# Altium schematic sheet C-04 CPU PWR.SchDoc
size 513 x 386 mm; Address1: 350W 9th Ave; Address2: Suite 206; Address3: Escondido CA 92025; Address4: United States; Revision: -; ENG_APP_DATE: --/--/--; DSN_APP_DATE: --/--/--; CHK_APP_DATE: --/--/--
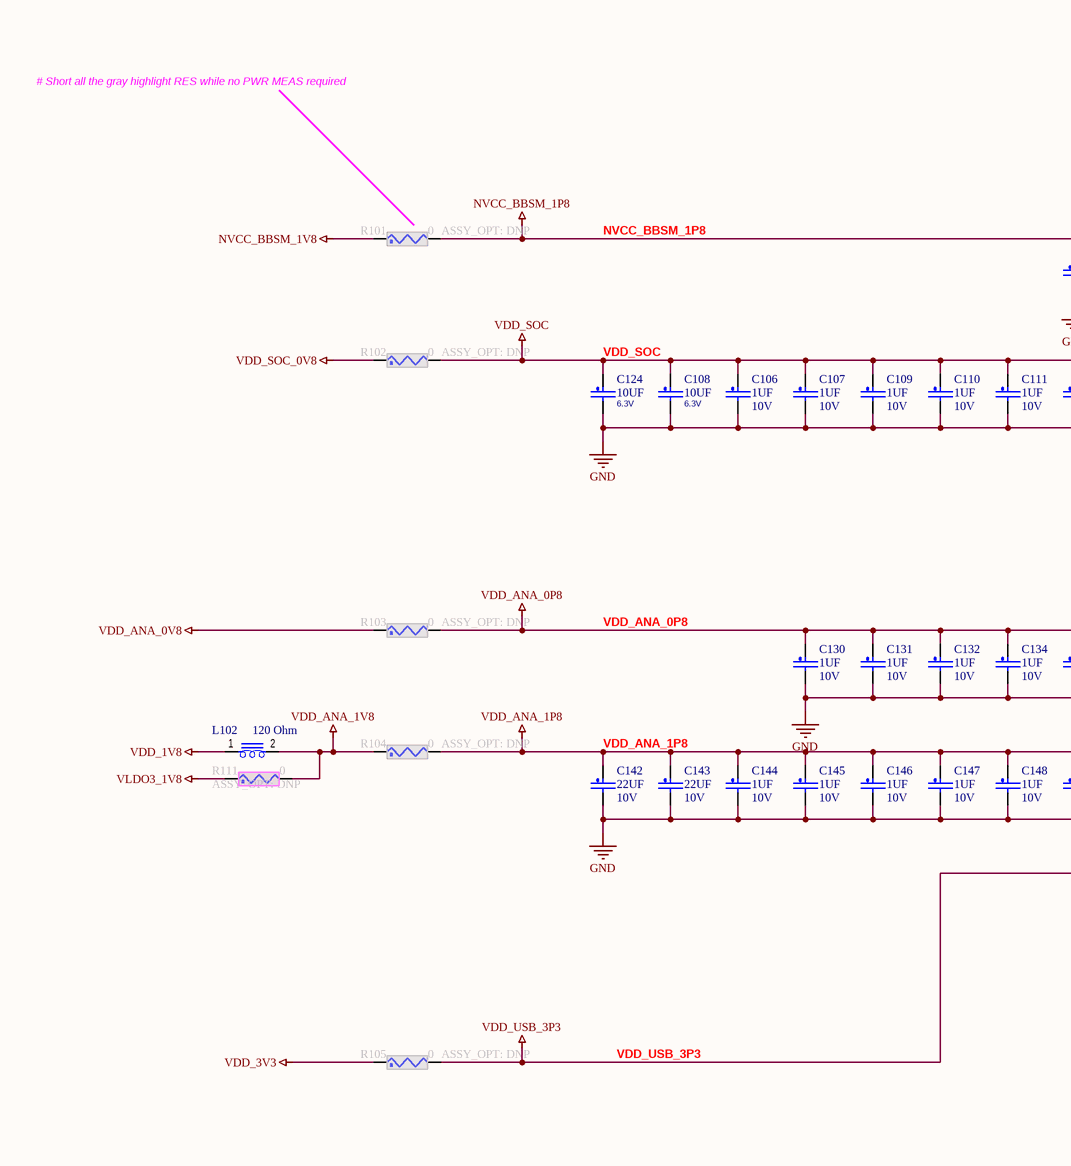
[diagram p0: C-04 CPU PWR.SchDoc, left]
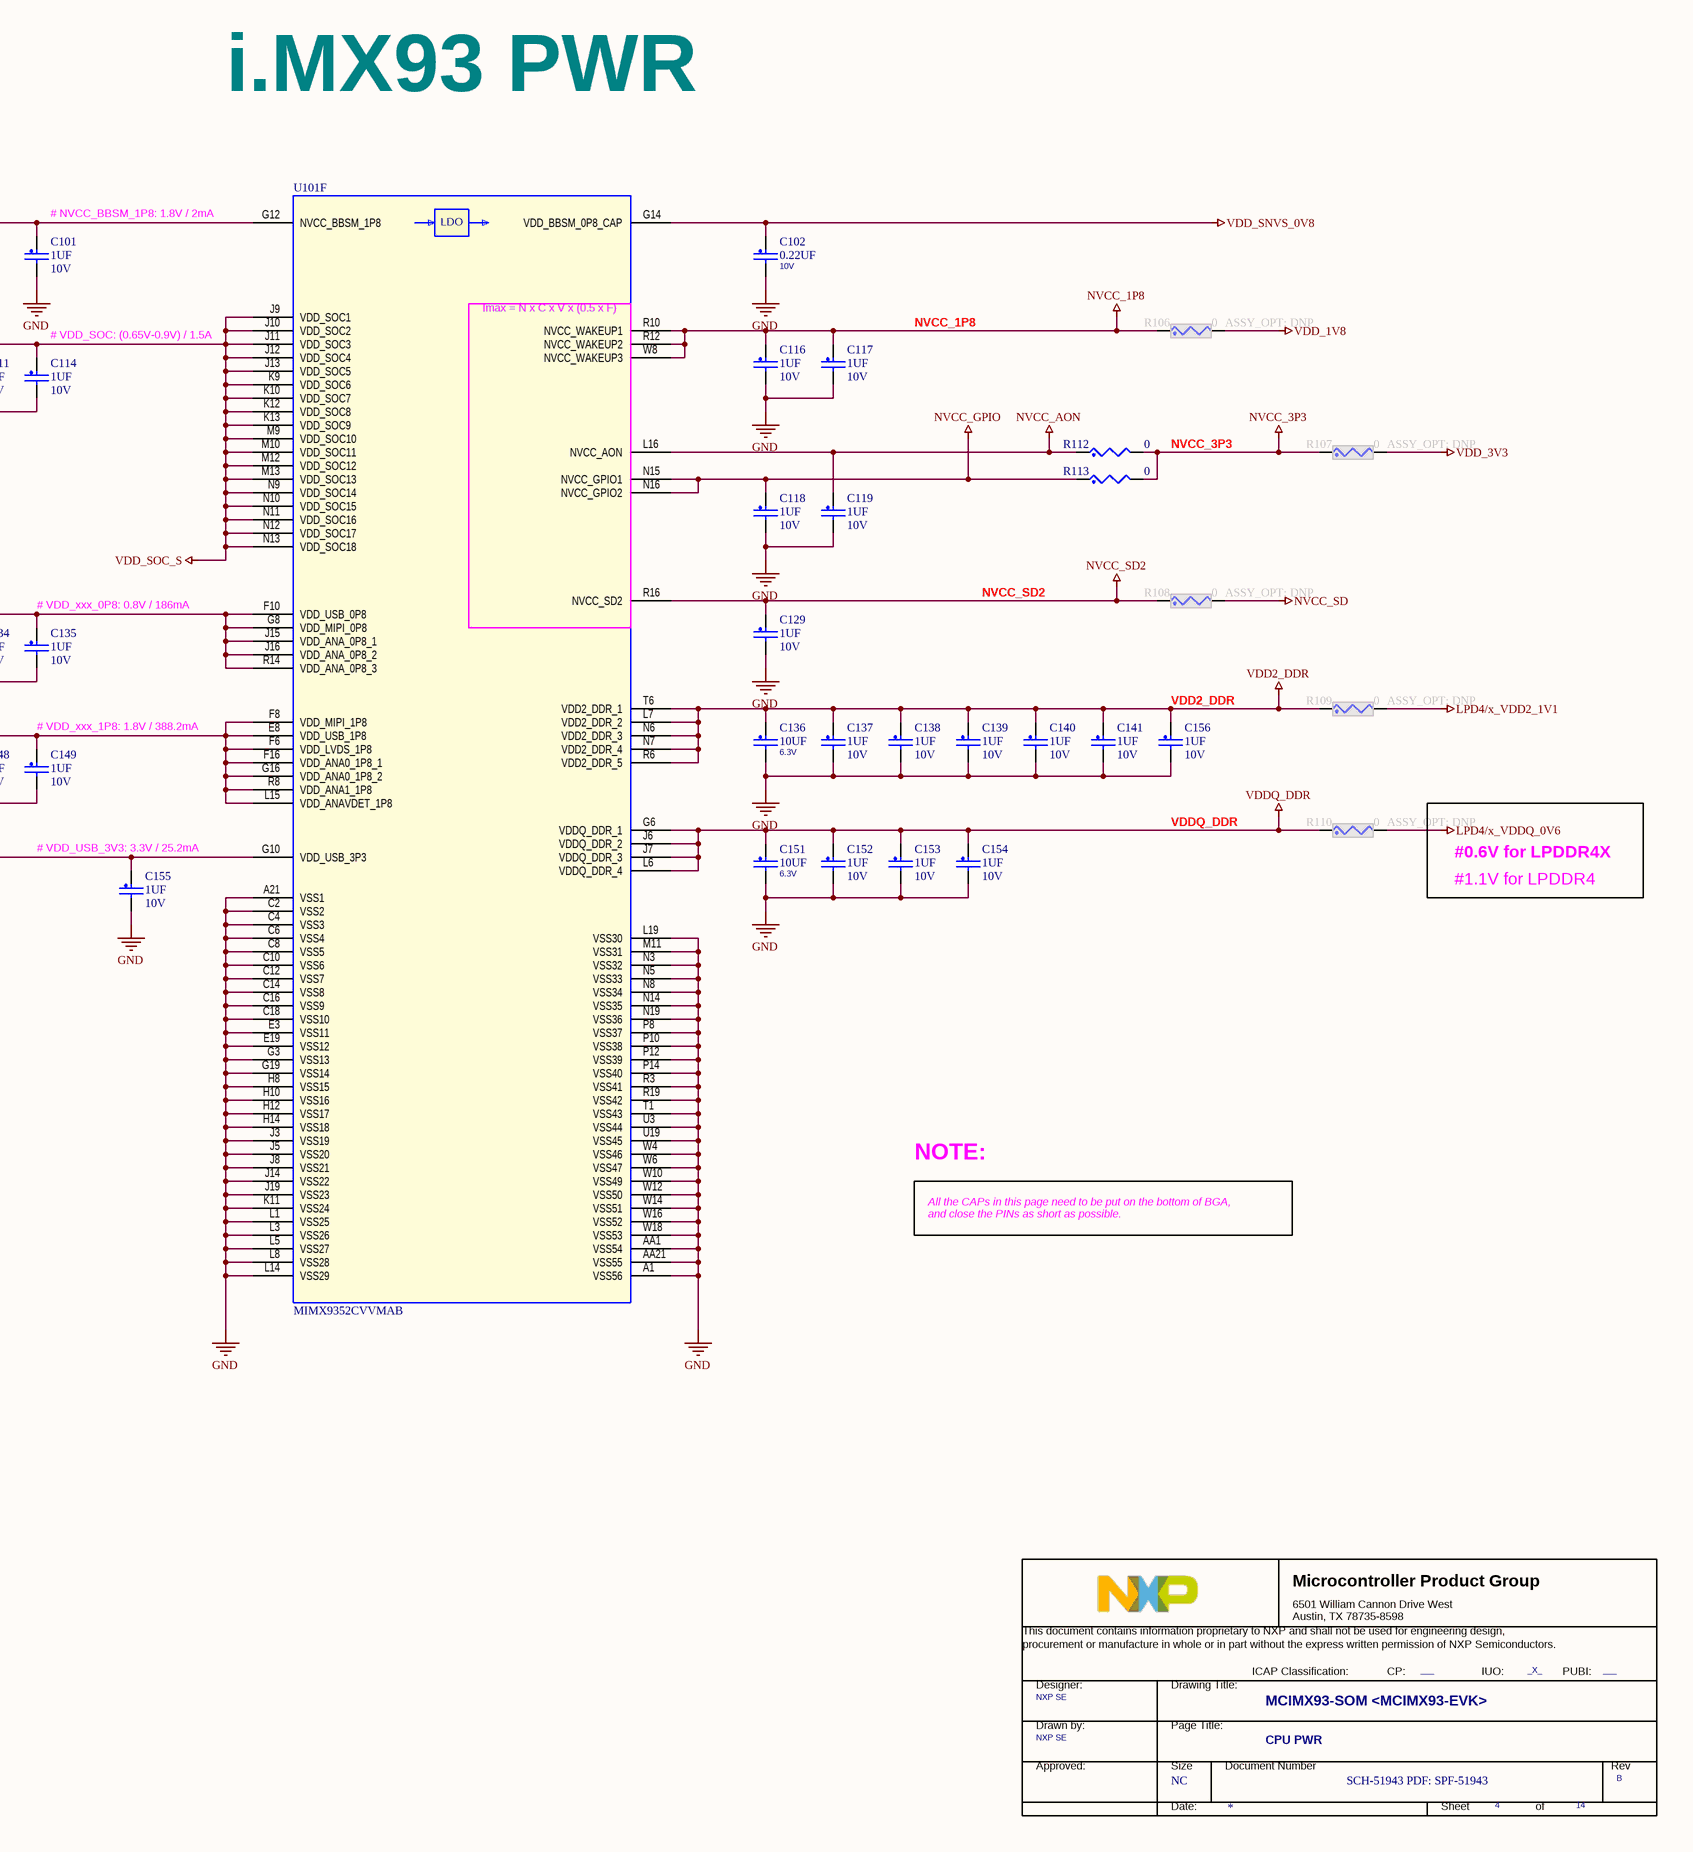
[diagram p1: C-04 CPU PWR.SchDoc, right]

## Parts
*  Doc: SCH-51943 PDF: SPF-51943  RevCode: B  Title: MCIMX93-SOM <MCIMX93-EVK>  Page Size: NC  Page Number: 4  Page Count: 14  PageTitle: CPU PWR  Designer: NXP SE  PUBI: ___  FIUO: _X_  (hidden comment: TitleBlock_MCPG)  (graphical)
C101  1UF  VOLTAGE: 10V  [0201_CC]
C102  0.22UF  VOLTAGE: 10V  [0201_CC]
C106  1UF  VOLTAGE: 10V  [0201_CC]
C107  1UF  VOLTAGE: 10V  [0201_CC]
C108  10UF  VOLTAGE: 6.3V  [0402_CC]
C109  1UF  VOLTAGE: 10V  [0201_CC]
C110  1UF  VOLTAGE: 10V  [0201_CC]
C111  1UF  VOLTAGE: 10V  [0201_CC]
C114  1UF  VOLTAGE: 10V  [0201_CC]
C116  1UF  VOLTAGE: 10V  [0201_CC]
C117  1UF  VOLTAGE: 10V  [0201_CC]
C118  1UF  VOLTAGE: 10V  [0201_CC]
C119  1UF  VOLTAGE: 10V  [0201_CC]
C124  10UF  VOLTAGE: 6.3V  [0402_CC]
C129  1UF  VOLTAGE: 10V  [0201_CC]
C130  1UF  VOLTAGE: 10V  [0201_CC]
C131  1UF  VOLTAGE: 10V  [0201_CC]
C132  1UF  VOLTAGE: 10V  [0201_CC]
C134  1UF  VOLTAGE: 10V  [0201_CC]
C135  1UF  VOLTAGE: 10V  [0201_CC]
C136  10UF  VOLTAGE: 6.3V  [0402_CC]
C137  1UF  VOLTAGE: 10V  [0201_CC]
C138  1UF  VOLTAGE: 10V  [0201_CC]
C139  1UF  VOLTAGE: 10V  [0201_CC]
C140  1UF  VOLTAGE: 10V  [0201_CC]
C141  1UF  VOLTAGE: 10V  [0201_CC]
C142  22UF  VOLTAGE: 10V  [CC0603]
C143  22UF  VOLTAGE: 10V  [CC0603]
C144  1UF  VOLTAGE: 10V  [0201_CC]
C145  1UF  VOLTAGE: 10V  [0201_CC]
C146  1UF  VOLTAGE: 10V  [0201_CC]
C147  1UF  VOLTAGE: 10V  [0201_CC]
C148  1UF  VOLTAGE: 10V  [0201_CC]
C149  1UF  VOLTAGE: 10V  [0201_CC]
C151  10UF  VOLTAGE: 6.3V  [0402_CC]
C152  1UF  VOLTAGE: 10V  [0201_CC]
C153  1UF  VOLTAGE: 10V  [0201_CC]
C154  1UF  VOLTAGE: 10V  [0201_CC]
C155  1UF  VOLTAGE: 10V  [0201_CC]
C156  1UF  VOLTAGE: 10V  [0201_CC]
L102  120 Ohm  [IND_0603]
R101  0  ASSY_OPT: DNP  [0402_CC]
R102  0  ASSY_OPT: DNP  [RC0805_OV]
R103  0  ASSY_OPT: DNP  [0603_CC]
R104  0  ASSY_OPT: DNP  [0603_CC]
R105  0  ASSY_OPT: DNP  [0402_CC]
R106  0  ASSY_OPT: DNP  [0402_CC]
R107  0  ASSY_OPT: DNP  [0402_CC]
R108  0  ASSY_OPT: DNP  [0402_CC]
R109  0  ASSY_OPT: DNP  [0603_CC]
R110  0  ASSY_OPT: DNP  [0603_CC]
R111  0  ASSY_OPT: DNP  [0603_CC]
R112  0  [0402_CC]
R113  0  [0402_CC]
U101  MIMX9352CVVMAB  [SKT_BGA306_0P5_SQ16P23_ELAST]  (part F of 6)

## Nets
GND: C101.2 C102.2 C106.2 C107.2 C108.2 C109.2 C110.2 C111.2 C114.2 C116.2 C117.2 C118.2 C119.2 C124.2 C129.2 C130.2 C131.2 C132.2 C134.2 C135.2 C136.2 C137.2 C138.2 C139.2 C140.2 C141.2 C142.2 C143.2 C144.2 C145.2 C146.2 C147.2 C148.2 C149.2 C151.2 C152.2 C153.2 C154.2 C155.2 C156.2 U101.A1(VSS56) U101.A21(VSS1) U101.AA1(VSS54) U101.AA21(VSS55) U101.C2(VSS2) U101.C4(VSS3) U101.C6(VSS4) U101.C8(VSS5) U101.C10(VSS6) U101.C12(VSS7) U101.C14(VSS8) U101.C16(VSS9) U101.C18(VSS10) U101.E3(VSS11) U101.E19(VSS12) U101.G3(VSS13) U101.G19(VSS14) U101.H8(VSS15) U101.H10(VSS16) U101.H12(VSS17) U101.H14(VSS18) U101.J3(VSS19) U101.J5(VSS20) U101.J8(VSS21) U101.J14(VSS22) U101.J19(VSS23) U101.K11(VSS24) U101.L1(VSS25) U101.L3(VSS26) U101.L5(VSS27) U101.L8(VSS28) U101.L14(VSS29) U101.L19(VSS30) U101.M11(VSS31) U101.N3(VSS32) U101.N5(VSS33) U101.N8(VSS34) U101.N14(VSS35) U101.N19(VSS36) U101.P8(VSS37) U101.P10(VSS38) U101.P12(VSS39) U101.P14(VSS40) U101.R3(VSS41) U101.R19(VSS42) U101.T1(VSS43) U101.U3(VSS44) U101.U19(VSS45) U101.W4(VSS46) U101.W6(VSS47) U101.W10(VSS49) U101.W12(VSS50) U101.W14(VSS51) U101.W16(VSS52) U101.W18(VSS53)
LPD4/x_VDD2_1V1: R109.2
LPD4/x_VDDQ_0V6: R110.2
NVCC_1P8: C116.1 C117.1 R106.1 U101.R10(NVCC_WAKEUP1) U101.R12(NVCC_WAKEUP2) U101.W8(NVCC_WAKEUP3)
NVCC_3P3: R107.1 R112.2 R113.2
NVCC_AON: C119.1 R112.1 U101.L16(NVCC_AON)
NVCC_BBSM_1P8: C101.1 R101.2 U101.G12(NVCC_BBSM_1P8)
NVCC_BBSM_1V8: R101.1
NVCC_GPIO: C118.1 R113.1 U101.N15(NVCC_GPIO1) U101.N16(NVCC_GPIO2)
NVCC_SD: R108.2
NVCC_SD2: C129.1 R108.1 U101.R16(NVCC_SD2)
VDD2_DDR: C136.1 C137.1 C138.1 C139.1 C140.1 C141.1 C156.1 R109.1 U101.L7(VDD2_DDR_2) U101.N6(VDD2_DDR_3) U101.N7(VDD2_DDR_4) U101.R6(VDD2_DDR_5) U101.T6(VDD2_DDR_1)
VDD_1V8: L102.1 R106.2
VDD_3V3: R105.1 R107.2
VDD_ANA_0P8: C130.1 C131.1 C132.1 C134.1 C135.1 R103.2 U101.F10(VDD_USB_0P8) U101.G8(VDD_MIPI_0P8) U101.J15(VDD_ANA_0P8_1) U101.J16(VDD_ANA_0P8_2) U101.R14(VDD_ANA_0P8_3)
VDD_ANA_0V8: R103.1
VDD_ANA_1P8: C142.1 C143.1 C144.1 C145.1 C146.1 C147.1 C148.1 C149.1 R104.2 U101.E8(VDD_USB_1P8) U101.F6(VDD_LVDS_1P8) U101.F8(VDD_MIPI_1P8) U101.F16(VDD_ANA0_1P8_1) U101.G16(VDD_ANA0_1P8_2) U101.L15(VDD_ANAVDET_1P8) U101.R8(VDD_ANA1_1P8)
VDD_ANA_1V8: L102.2 R104.1 R111.2
VDD_SNVS_0V8: C102.1 U101.G14(VDD_BBSM_0P8_CAP)
VDD_SOC: C106.1 C107.1 C108.1 C109.1 C110.1 C111.1 C114.1 C124.1 R102.2 U101.J9(VDD_SOC1) U101.J10(VDD_SOC2) U101.J11(VDD_SOC3) U101.J12(VDD_SOC4) U101.J13(VDD_SOC5) U101.K9(VDD_SOC6) U101.K10(VDD_SOC7) U101.K12(VDD_SOC8) U101.K13(VDD_SOC9) U101.M9(VDD_SOC10) U101.M10(VDD_SOC11) U101.M12(VDD_SOC12) U101.M13(VDD_SOC13) U101.N9(VDD_SOC14) U101.N10(VDD_SOC15) U101.N11(VDD_SOC16) U101.N12(VDD_SOC17) U101.N13(VDD_SOC18)  [also labelled VDD_SOC_S]
VDD_SOC_0V8: R102.1
VDD_USB_3P3: C155.1 R105.2 U101.G10(VDD_USB_3P3)
VDDQ_DDR: C151.1 C152.1 C153.1 C154.1 R110.1 U101.G6(VDDQ_DDR_1) U101.J6(VDDQ_DDR_2) U101.J7(VDDQ_DDR_3) U101.L6(VDDQ_DDR_4)
VLDO3_1V8: R111.1

## Notes on the sheet
- # Short all the gray highlight RES while no PWR MEAS required
- i.MX93 PWR
- (near C101) # NVCC_BBSM_1P8: 1.8V / 2mA
- (near C114) # VDD_SOC: (0.65V-0.9V) / 1.5A
- (near U101) Imax = N x C x V x (0.5 x F)
- (near C135) # VDD_xxx_0P8: 0.8V / 186mA
- (near C149) # VDD_xxx_1P8: 1.8V / 388.2mA
- (near C155) # VDD_USB_3V3: 3.3V / 25.2mA
- #1.1V for LPDDR4
- #0.6V for LPDDR4X
- NOTE:
- All the CAPs in this page need to be put on the bottom of BGA,
  and close the PINs as short as possible.
- 8
- 7
- 6
- 5
- 4
- 3
- 2
- 1
- REVISION
- DESCRIPTION
- DATE
- APPROVED
- F
- E
- D
- C
- B
- PROJECT:
- REV.
- ENG:
- APPROVALS
- PROJECT
- JordanDSP LLC <https://www.jordandsp.com>
- Envision Excellence
- SHT.
- A
- DSN:
- CHK:
- REFERENCE ITEMS
- PRJ VCS REVISION:
- TITLE
- DOC VCS REVISION:
- MODIFIED DATE:
- BOM:
- FAB DWG:
- FIRMWARE:
- ASSY DWG:
- SCALE:
- SIZE
- CAGE CODE
- FILE NAME
- DWG NO.
- PAGE
- PRODUCT REV
- OF
- (in symbol MIMX9352DVNxLAA, part F) LDO
- (in symbol TitleBlock_MCPG) Microcontroller Product Group; 6501 William Cannon Drive West / Austin, TX 78735-8598; This document contains information proprietary to NXP and shall not be used for engineering design,; procurement or manufacture in whole or in part without the express written permission of NXP Semiconductors.; ICAP Classification:; CP:; IUO:; PUBI:; Designer:; Drawing Title:; Drawn by:; Page Title:; Approved:; Size; Document Number; Rev; Date:; Sheet; of

## Library data of the parts
* = TitleBlock_MCPG: OrgName: NXP Semiconductor; OrgAddr1: NO. 192 Liangjing Rd. Pudong New Area, ShangHai; Page Create Date: March  8, 1995; DrawnBy: NXP SE; FCP: ___; Page Modify Date: *
C101 C110 C111 C129 C137-C141 C144 C147 C155 = CAP_NP: CAP CER 1.0uF 10V 10% X5R 0201; CLASS: DISCRETE; AGILE_PN: 150-81088; MFG_NAME01: SAMSUNG ELECTRO MECHANICS; MFG_PN01: CL03A105KP3NSNC; CAD_APPROVED: Yes; FPLIST: CC0201,CC0201_HD,0201_CC,cc_0201_cir; Temp Range: -55¡ãC to 85¡ãC; Package Type: SMD/SMT; Package Size: 0201 (0603 Metric); Tolerance: 10%; ROHS: Yes; HEIGHT: 0.35MM; PCB Footprint: 0201_CC
C102 = CAP_NP: CAP CER 0.22UF 10V 20% X5R 0201; CLASS: DISCRETE; AGILE_PN: 150-78815; MFG_NAME01: Taiyo Yuden; MFG_PN01: LMK063BJ224MP-F; CAD_APPROVED: Yes; FPLIST: CC0201,CC0201_HD,0201_CC; Tolerance: 20%; ROHS: Yes; HEIGHT: 0.33MM; PCB Footprint: 0201_CC
C106 C107 C130-C132 C145 C146 C148 C149 C152-C154 = CAP_NP: CAP CER 1.0uF 10V 10% X5R 0201; CLASS: DISCRETE; FPLIST: CC0201,CC0201_HD,0201_CC,cc_0201_cir; CAD_APPROVED: Yes; MFG_PN01: CL03A105KP3NSNC; MFG_NAME01: SAMSUNG ELECTRO MECHANICS; AGILE_PN: 150-81088; Temp Range: -55¡ãC to 85¡ãC; Package Type: SMD/SMT; Package Size: 0201 (0603 Metric); HEIGHT: 0.35MM; ROHS: Yes; Tolerance: 10%; PCB Footprint: 0201_CC
C108 C124 C136 = CAP_NP: CAP CER 10UF 6.3V 20% X5R 0402; CLASS: DISCRETE; AGILE_PN: 150-79163; MFG_NAME01: SAMSUNG ELECTRO MECHANICS; MFG_PN01: CL05A106MQ5NUNC; CAD_APPROVED: Yes; FPLIST: CC0402_25,CC0402_HD,0402_CC; Tolerance: 20%; ROHS: Yes; HEIGHT: 0.65 MM; PCB Footprint: 0402_CC
C109 C114 C116-C119 C156 = CAP_NP: CAP CER 1.0uF 10V 10% X5R 0201; CLASS: DISCRETE; Temp Range: -55¡ãC to 85¡ãC; FPLIST: CC0201,CC0201_HD,0201_CC,cc_0201_cir; CAD_APPROVED: Yes; MFG_PN01: CL03A105KP3NSNC; MFG_NAME01: SAMSUNG ELECTRO MECHANICS; AGILE_PN: 150-81088; Package Type: SMD/SMT; Package Size: 0201 (0603 Metric); HEIGHT: 0.35MM; ROHS: Yes; Tolerance: 10%; PCB Footprint: 0201_CC
C134 C135 = CAP_NP: CAP CER 1.0uF 10V 10% X5R 0201; CLASS: DISCRETE; Temp Range: -55¡ãC to 85¡ãC; AGILE_PN: 150-81088; MFG_NAME01: SAMSUNG ELECTRO MECHANICS; MFG_PN01: CL03A105KP3NSNC; CAD_APPROVED: Yes; FPLIST: CC0201,CC0201_HD,0201_CC,cc_0201_cir; Tolerance: 10%; ROHS: Yes; HEIGHT: 0.35MM; Package Size: 0201 (0603 Metric); Package Type: SMD/SMT; PCB Footprint: 0201_CC
C142 = CAP_NP: CAP CER 22uF 10V 20% X5R 0603; CLASS: DISCRETE; FPLIST: CC0603_OV,CC0603,0603_cc_tol; CAD_APPROVED: Yes; MFG_PN01: C1608X5R1A226M080AC; MFG_NAME01: TDK; AGILE_PN: 150-79530; WVDC: 6.3V; SIGNAL_MODEL: DEFAULT_CAPACITOR_2.2e+07pF_2_1; PCB Footprint: CC0603; HEIGHT: 1MM; ROHS: Yes; Tolerance: 20%; Package Size: 0603
C143 = CAP_NP: CAP CER 22uF 10V 20% X5R 0603; CLASS: DISCRETE; SIGNAL_MODEL: DEFAULT_CAPACITOR_2.2e+07pF_2_1; WVDC: 6.3V; AGILE_PN: 150-79530; MFG_NAME01: TDK; MFG_PN01: C1608X5R1A226M080AC; CAD_APPROVED: Yes; FPLIST: CC0603_OV,CC0603,0603_cc_tol; PCB Footprint: CC0603; Package Size: 0603; Tolerance: 20%; ROHS: Yes; HEIGHT: 1MM
C151 = CAP_NP: CAP CER 10UF 6.3V 20% X5R 0402; CLASS: DISCRETE; FPLIST: CC0402_25,CC0402_HD,0402_CC; CAD_APPROVED: Yes; MFG_PN01: CL05A106MQ5NUNC; MFG_NAME01: SAMSUNG ELECTRO MECHANICS; AGILE_PN: 150-79163; PCB Footprint: 0402_CC; HEIGHT: 0.65 MM; ROHS: Yes; Tolerance: 20%
L102 = BEAD_0: IND FER BEAD 120OHM@100MHZ 2A 25% 0603; CLASS: DISCRETE; MFG_PN01: BLM18PG121SN1D; MFG_NAME01: MURATA; CAD_APPROVED: Yes; FPLIST: IND_0603,0603_CC; AGILE_PN: 180-78419; ROHS: Yes; HEIGHT: 0.95MM; PCB Footprint: IND_0603
R101 R105-R108 R112 R113 = RES: RES MF ZERO OHM 1/16W 5% 0402; CLASS: DISCRETE; FPLIST: RC0402_25,RC0402_HD,RC0402_X2,0402_CC; CAD_APPROVED: Yes; MFG_PN01: RC0402JR-070RL; MFG_NAME01: YAGEO AMERICA; AGILE_PN: 470-75394; PCB Footprint: 0402_CC; HEIGHT: 0.45 MM; ROHS: Yes; Tolerance: 5%; VOLTAGE: 1/16W
R102 = RES: RES MF ZERO OHM 1/8W -- 0805; CLASS: DISCRETE; AGILE_PN: 470-75442; FPLIST: RC0805_OV,RC0805,RC0805_OV_3P,0805_CC; Tolerance: 5%; CAD_APPROVED: Yes; Temp Range: ¨C55 ¡ãC to +155 ¡ãC; MFG_NAME01: YAGEO AMERICA; MFG_PN01: RC0805JR-070RL; PCB Footprint: RC0805_OV; HEIGHT: 0.7 MM; ROHS: Yes
R103 = RES: RES MF ZERO OHM 1/10W -- 0603; CLASS: DISCRETE; Temp Range: ¨C55 ¡ãC to +155 ¡ãC; FPLIST: RC0603_OV,RC0603,R603-X2,0603_CC,IND_0603HP_NSP,CC0603_OV_NSP; CAD_APPROVED: Yes; MFG_PN01: WR06X000PTL; MFG_NAME01: WALSIN TECHNOLOGY CORP.; AGILE_PN: 470-80866; PCB Footprint: 0603_CC; HEIGHT: 0.6MM; ROHS: Yes
R104 R109-R111 = RES: RES MF ZERO OHM 1/10W -- 0603; CLASS: DISCRETE; AGILE_PN: 470-80866; MFG_NAME01: WALSIN TECHNOLOGY CORP.; MFG_PN01: WR06X000PTL; CAD_APPROVED: Yes; FPLIST: RC0603_OV,RC0603,R603-X2,0603_CC,IND_0603HP_NSP,CC0603_OV_NSP; Temp Range: ¨C55 ¡ãC to +155 ¡ãC; PCB Footprint: 0603_CC; ROHS: Yes; HEIGHT: 0.6MM
U101 = MIMX9352DVNxLAA: SUBASSEMBLY SKT 306 BGA ELASTOMER SMT 0.5MM 395H AU + IC CPU 1.7GHz -- FCBGA306; MFG_PN01: 211-81728,330-77207; CAD_APPROVED: Yes; FPLIST: skt_bga306_0p5_sq16p23_elast,skt_bga306_0p5_sq16p23_elast_nsp; AGILE_PN: 750-78710; PCB Footprint: skt_bga306_0p5_sq16p23_elast_nsp; CLASS: IC; MFG_NAME01: SUBASSEMBLY; ROHS: Yes; HEIGHT: 10.03MM; Manufacturer Part Number: MIMX9352CVVMAB